# Altium project dsp_board.PrjPcb
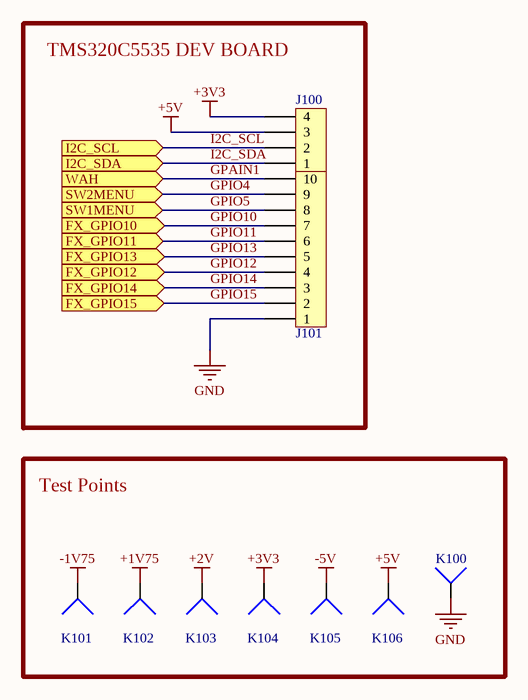
[diagram p0: main.SchDoc]
6 sheets, 140 parts. Net scope: flat (ports and power ports of the same name join across sheets).
Board files: PCB2.PcbDoc, PCBV4.PcbDoc
Sheets:
  main.SchDoc
  switches_connectors.SchDoc
  amplifier_stage.SchDoc
  switches_LEDs.SchDoc
  regulators.SchDoc
  power_supply.SchDoc

## Sheet main.SchDoc
size A4; SheetNumber: 1; SheetTotal: 6

### Parts
J100  Header 1x4  [Header 1x4]  (value not drawn)
J101  Header 1x10  [Header 1x10]  (value not drawn)
K100  Wire  [Wire 1.5mm]  (value not drawn)
K101  Wire  [Wire 1.5mm]  (value not drawn)
K102  Wire  [Wire 1.5mm]  (value not drawn)
K103  Wire  [Wire 1.5mm]  (value not drawn)
K104  Wire  [Wire 1.5mm]  (value not drawn)
K105  Wire  [Wire 1.5mm]  (value not drawn)
K106  Wire  [Wire 1.5mm]  (value not drawn)

### Blocks framed on the sheet
TMS320C5535 DEV BOARD: J100 J101
Test Points: K100-K106

### Ports
FX_GPIO10 (in), FX_GPIO11 (in), FX_GPIO12 (in), FX_GPIO13 (in), FX_GPIO14 (in), FX_GPIO15 (in), I2C_SCL (in), I2C_SDA (in), SW1MENU (in), SW2MENU (in), WAH (in)

### Nets
+1V75: K102.1
+2V: K103.1
+3V3: J100.4 K104.1
+5V: J100.3 K106.1
-1V75: K101.1
-5V: K105.1
GND: J101.1 K100.1
GPAIN1: J101.10 ; port WAH
GPIO4: J101.9 ; port SW2MENU
GPIO5: J101.8 ; port SW1MENU
GPIO10: J101.7 ; port FX_GPIO10
GPIO11: J101.6 ; port FX_GPIO11
GPIO12: J101.4 ; port FX_GPIO12
GPIO13: J101.5 ; port FX_GPIO13
GPIO14: J101.3 ; port FX_GPIO14
GPIO15: J101.2 ; port FX_GPIO15
I2C_SCL: J100.2 ; port I2C_SCL
I2C_SDA: J100.1 ; port I2C_SDA

### Notes on the sheet
- Title
- Size:
- Date:
- A4
- Project:
- Time:
- Version:
- Sheet
- of
- File:
- Author:

## Sheet switches_connectors.SchDoc
size A4; SheetNumber: 2; SheetTotal: 6
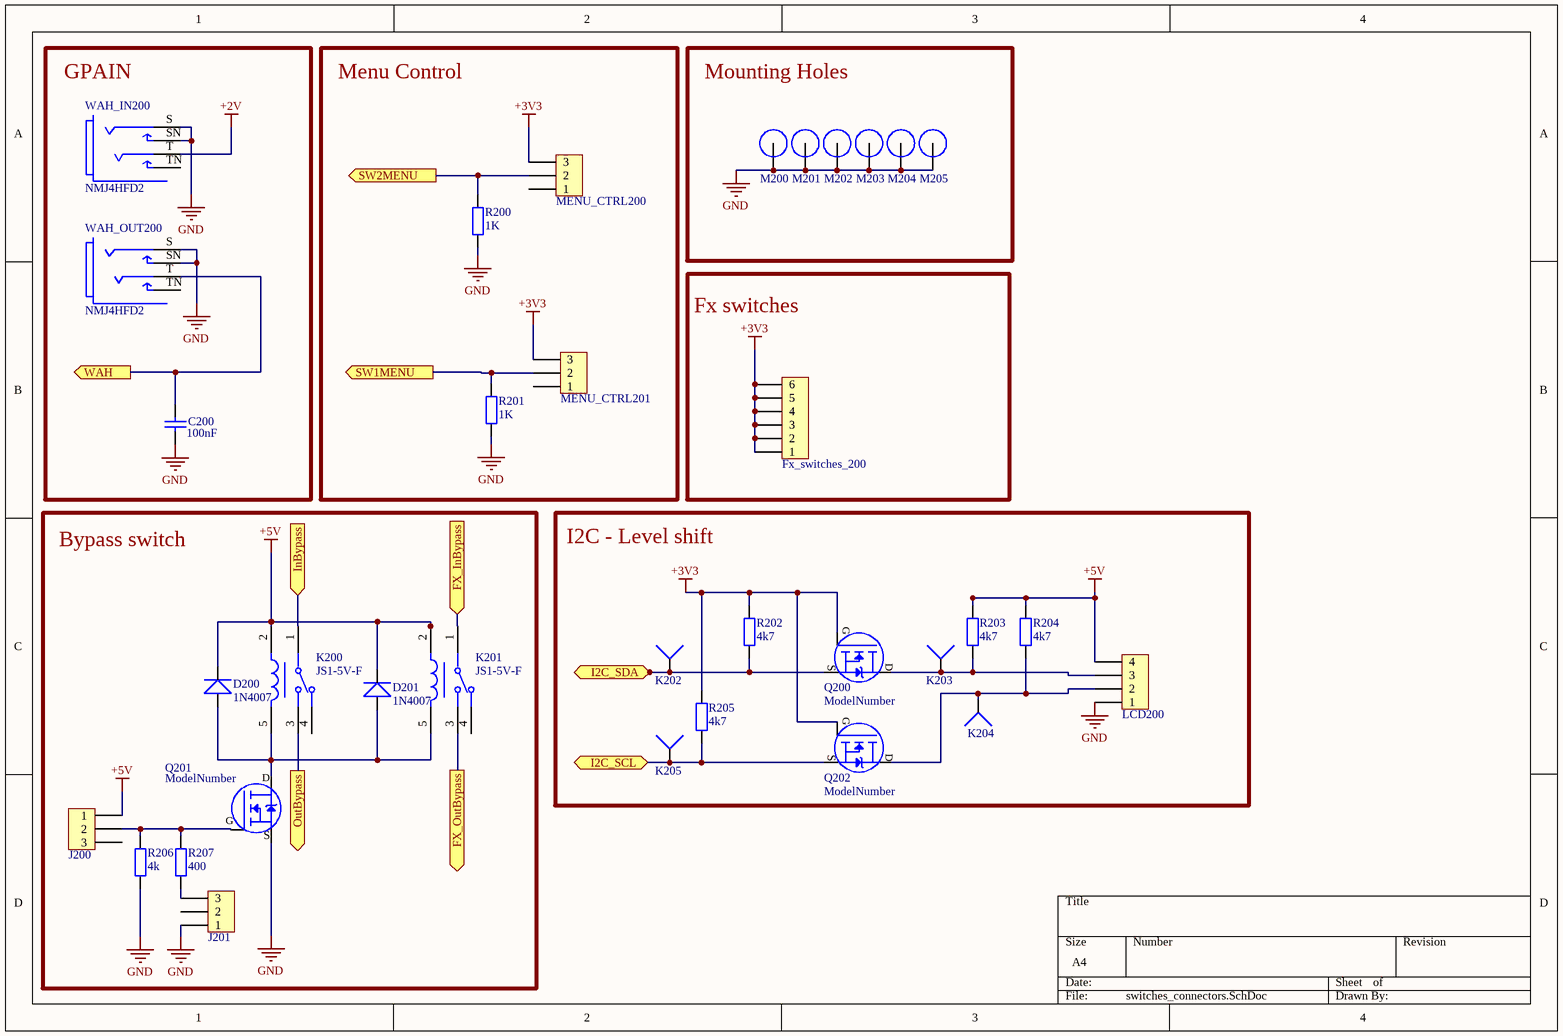
[diagram p1: switches_connectors.SchDoc]

### Parts
C200  value 100nF  [Cap-1]  (hidden comment: Cap)
D200  1N4007  [1N4007]
D201  1N4007  [1N4007]
Fx_switches_200  Header 1x6  [Header 1x6]  (value not drawn)
J200  Header 1x3  [Header 1x3]  (value not drawn)
J201  Header 1x3  [Header 1x3]  (value not drawn)
K200  JS1-5V-F  [FP-JS1-5V-F-MFG]
K201  JS1-5V-F  [FP-JS1-5V-F-MFG]
K202  Wire  [Wire 1.5mm]  (value not drawn)
K203  Wire  [Wire 1.5mm]  (value not drawn)
K204  Wire  [Wire 1.5mm]  (value not drawn)
K205  Wire  [Wire 1.5mm]  (value not drawn)
LCD200  Header 1x4  [Header 1x4]  (value not drawn)
M200  Screw Hole  [M3 Hole]  (value not drawn)  (no BOM)
M201  Screw Hole  [M3 Hole]  (value not drawn)  (no BOM)
M202  Screw Hole  [M3 Hole]  (value not drawn)  (no BOM)
M203  Screw Hole  [M3 Hole]  (value not drawn)  (no BOM)
M204  Screw Hole  [M3 Hole]  (value not drawn)  (no BOM)
M205  Screw Hole  [M3 Hole]  (value not drawn)  (no BOM)
MENU_CTRL200  Header 1x3  [Header 1x3]  (value not drawn)
MENU_CTRL201  Header 1x3  [Header 1x3]  (value not drawn)
Q200  Model: ModelNumber  [TO-92_straight]  (hidden comment: ModelNum)
Q201  Model: ModelNumber  [TO-220]  (hidden comment: ModelNum)
Q202  Model: ModelNumber  [TO-92_straight]  (hidden comment: ModelNum)
R200  value 1K  [RES THT 9mm]  (hidden comment: Resistor)
R201  value 1K  [RES THT 9mm]  (hidden comment: Resistor)
R202  value 4k7  [RES THT 9mm]  (hidden comment: Resistor)
R203  value 4k7  [RES THT 9mm]  (hidden comment: Resistor)
R204  value 4k7  [RES THT 9mm]  (hidden comment: Resistor)
R205  value 4k7  [RES THT 9mm]  (hidden comment: Resistor)
R206  value 4k  [RES THT 9mm]  (hidden comment: Resistor)
R207  value 400  [RES THT 9mm]  (hidden comment: Resistor)
WAH_IN200  NMJ4HFD2  [FP-NMJ4HFD2-MFG]
WAH_OUT200  NMJ4HFD2  [FP-NMJ4HFD2-MFG]

### Blocks framed on the sheet
GPAIN: C200 WAH_IN200 WAH_OUT200
Menu Control: MENU_CTRL200 MENU_CTRL201 R200 R201
Mounting Holes: M200-M205
Fx switches: Fx_switches_200
Bypass switch: D200 D201 J200 J201 K200 K201 Q201 R206 R207
I2C - Level shift: K202-K205 LCD200 Q200 Q202 R202-R205

### Ports
FX_InBypass (in), FX_OutBypass (out), I2C_SCL (bidir), I2C_SDA (bidir), InBypass (in), OutBypass (out), SW1MENU (out), SW2MENU (out), WAH (out)

### Nets
+2V: WAH_IN200.T
+3V3: Fx_switches_200.1 Fx_switches_200.2 Fx_switches_200.3 Fx_switches_200.4 Fx_switches_200.5 Fx_switches_200.6 MENU_CTRL200.3 MENU_CTRL201.3 Q200.1(G) Q202.1(G) R202.2 R205.2
+5V: D200.2 D201.2 J200.1 K200.2(1_COIL) K201.2(1_COIL) LCD200.4 R203.2 R204.2
GND: C200.1 J201.1 LCD200.1 M200.1 M201.1 M202.1 M203.1 M204.1 M205.1 Q201.3(S) R200.1 R201.1 R206.1 WAH_IN200.S WAH_IN200.SN WAH_OUT200.S WAH_OUT200.SN
GPAIN1: C200.2(g) WAH_OUT200.T ; port WAH
GPIO4: MENU_CTRL200.2 R200.2 ; port SW2MENU
GPIO5: MENU_CTRL201.2 R201.2 ; port SW1MENU
I2C_SCL: K205.1 Q202.3(S) R205.1 ; port I2C_SCL
I2C_SDA: K202.1 Q200.3(S) R202.1 ; port I2C_SDA
NetC302_1: K200.3(N.O.) ; port OutBypass
NetC303_1: K201.3(N.O.) ; port FX_OutBypass
NetD200_1: D200.1 D201.1 K200.5(2_COIL) K201.5(2_COIL) Q201.2(D)
NetD300_1: K200.1(COM) ; port InBypass
NetFX_LOOP_IN300_T: K201.1(COM) ; port FX_InBypass
NetJ200_2: J200.2 Q201.1(G) R206.2 R207.2
NetJ201_3: J201.3 R207.1
NetK203_1: K203.1 LCD200.3 Q200.2(D) R203.1
NetK204_1: K204.1 LCD200.2 Q202.2(D) R204.1

Not connected (* = marked no-connect by the designer): J200 3; J201 2; K200 4(N.C.); K201 4(N.C.); MENU_CTRL200 1; MENU_CTRL201 1; WAH_IN200 TN; WAH_OUT200 TN

### Library data of the parts
C200 = Capacitor 1 space
K200 K201 = CMP-05606-000016-1: RELAY GEN PURPOSE SPDT 10A 5V; Manufacturer: Panasonic; Coil Type: Non-Latching; Number Of Contacts: 1; Standoff Height: 0.3mm; Switching Power: 150W; Coil Power: 360mW; Coil Current: 72mA; Coil Resistance: 69.4Ω; Lead Free: Yes; Device Class L3: Power Relays; Device Class L1: Electromechanical; Ambient Temperature Range High: +70°C; Temperature: -40°C to +70°C; Temperature Range High: +70°C; Temperature Range Low: -40°C; Manufacturer Part Number: JS1-5V-F; Coil Voltage: 5V; Switching Current: 10A; Digikey Description: RELAY GEN PURPOSE SPDT 10A 5V; Device Class L2: Relays; Ambient Temperature Range Low: -40°C; Throw Configuration: SPDT; Category: Relay; ComponentLink2URL: https://www3.panasonic.biz/ac/e_download/control/relay/power/catalog/mech_eng_js.pdf?via=ok; Package: JS1-5V-F; Octopart: https://octopart.com/js1-5v-f-panasonic-39428621; Mouser Description: JS Series 10 A SPDT 5 V Through Hole Sealed Miniature Non-Polarized Power Relay; Height: 16.8mm; ComponentLink2Description: Datasheet; RoHS: TRUE; Automotive: No
Q200 Q202 = MOSFET N-Channel: pin to pad: 2>3 3>2
Q201 = MOSFET N-Channel
WAH_IN200 WAH_OUT200 = CMP-78736-000001-1: Conn 1/4" Mono Jack F 3 POS Solder RA Thru-Hole 3 Terminal 1 Port; Manufacturer: Neutrik; Number Of Contacts: 2; Current Rating: 0.5A; Voltage Rating: 50V; Conn Orientation: Horizontal; Is Female: yes; Temperature: -25°C to +70°C; ComponentLink2Description: Datasheet; ComponentLink2URL: https://www.neutrik.com/en/product/nmj4hfd2.pdf; Contact Material: Silver; Height: 15.89mm; Package: 0; Mouser Description: Phone Audio Connector, Socket, 2, PCB Mount, Metal Body, Silver Plated Contacts; Manufacturer Part Number: NMJ4HFD2; Automotive: No; RoHS: TRUE; Lead Free: Yes; Device Class L2: Audio / Video Connectors; Device Class L3: unset; Temperature Range Low: -25°C; Category: Conn; Footprint Url: https://www.neutrik.com/media/8576/download/st-nmj4hfd2.pdf?v=1; Temperature Range High: +70°C; Device Class L1: Connectors; Octopart: https://octopart.com/nmj4hfd2-neutrik-758952

## Sheet amplifier_stage.SchDoc
size A4; SheetNumber: 3; SheetTotal: 6
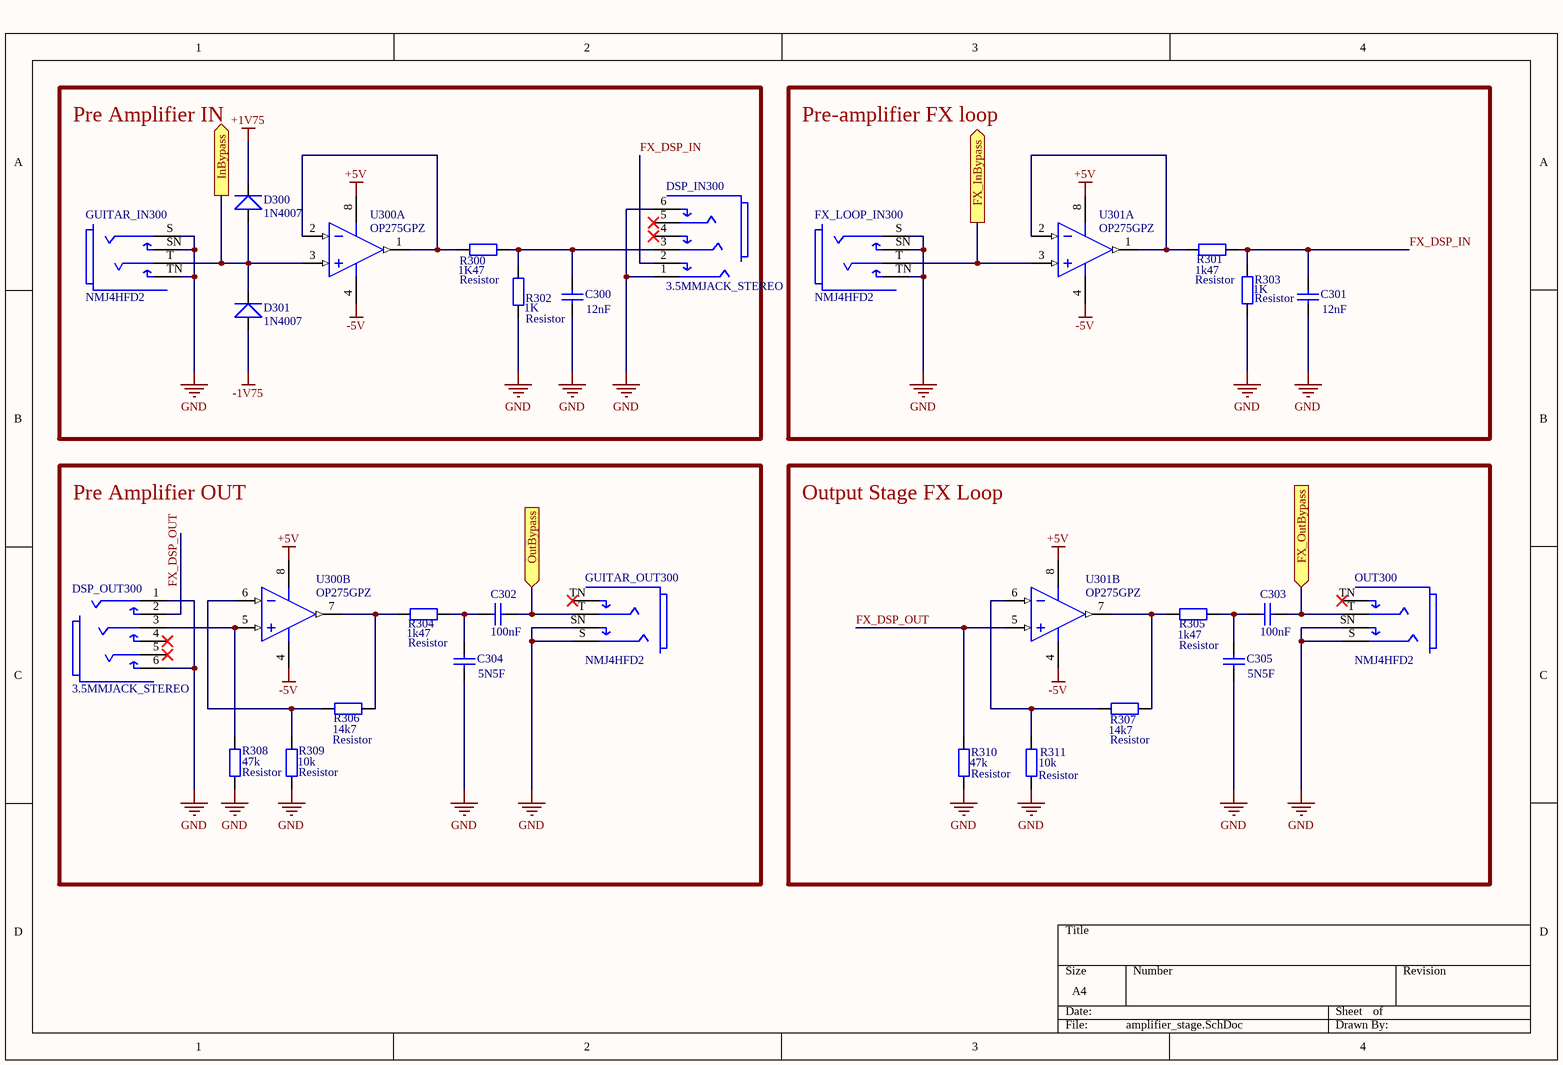
[diagram p2: amplifier_stage.SchDoc]

### Parts
C300  value 12nF  [Cap-1]  (hidden comment: Cap)
C301  value 12nF  [Cap-1]  (hidden comment: Cap)
C302  value 100nF  [Cap-1]  (hidden comment: Cap)
C303  value 100nF  [Cap-1]  (hidden comment: Cap)
C304  value 5N5F  [Cap-1]  (hidden comment: Cap)
C305  value 5N5F  [Cap-1]  (hidden comment: Cap)
D300  1N4007  [1N4007]
D301  1N4007  [1N4007]
DSP_IN300  3.5MMJACK_STEREO  [3.5MMJACK_STEREO]
DSP_OUT300  3.5MMJACK_STEREO  [3.5MMJACK_STEREO]
FX_LOOP_IN300  NMJ4HFD2  [FP-NMJ4HFD2-MFG]
GUITAR_IN300  NMJ4HFD2  [FP-NMJ4HFD2-MFG]
GUITAR_OUT300  NMJ4HFD2  [FP-NMJ4HFD2-MFG]
OUT300  NMJ4HFD2  [FP-NMJ4HFD2-MFG]
R300  Resistor  value 1K47  [RES THT 9mm]
R301  Resistor  value 1k47  [RES THT 9mm]
R302  Resistor  value 1K  [RES THT 9mm]
R303  Resistor  value 1K  [RES THT 9mm]
R304  Resistor  value 1k47  [RES THT 9mm]
R305  Resistor  value 1k47  [RES THT 9mm]
R306  Resistor  value 14k7  [RES THT 9mm]
R307  Resistor  value 14k7  [RES THT 9mm]
R308  Resistor  value 47k  [RES THT 9mm]
R309  Resistor  value 10k  [RES THT 9mm]
R310  Resistor  value 47k  [RES THT 9mm]
R311  Resistor  value 10k  [RES THT 9mm]
U300  OP275GPZ  [ADI-N-8]  (parts A,B of 2)
U301  OP275GPZ  [ADI-N-8]  (parts A,B of 2)

### Blocks framed on the sheet
Pre Amplifier IN: C300 D300 D301 DSP_IN300 GUITAR_IN300 R300 R302 U300
Pre-amplifier FX loop: C301 FX_LOOP_IN300 R301 R303 U301
Pre Amplifier OUT: C302 C304 DSP_OUT300 GUITAR_OUT300 R304 R306 R308 R309 U300
Output Stage FX Loop: C303 C305 OUT300 R305 R307 R310 R311 U301

### Ports
FX_InBypass (out), FX_OutBypass (in), InBypass (out), OutBypass (in)

### Nets
+1V75: D300.2
+5V: U300.8(+V) U301.8(+V)
-1V75: D301.1
-5V: U300.4(-V) U301.4(-V)
GND: C300.1 C301.1 C304.1 C305.1 DSP_IN300.1(S) DSP_IN300.6(TN) DSP_OUT300.1(S) DSP_OUT300.6(TN) FX_LOOP_IN300.S FX_LOOP_IN300.SN FX_LOOP_IN300.TN GUITAR_IN300.S GUITAR_IN300.SN GUITAR_IN300.TN GUITAR_OUT300.S GUITAR_OUT300.SN OUT300.S OUT300.SN R302.1 R303.1 R308.1 R309.1 R310.1 R311.1
FX_DSP_IN: C301.2(g) DSP_IN300.2(SN) R301.2 R303.2
FX_DSP_OUT: DSP_OUT300.2(SN) R310.2 U301.5(+IN_B)
NetC300_2: C300.2(g) DSP_IN300.3(S) R300.2 R302.2
NetC302_1: C302.1 GUITAR_OUT300.T ; port OutBypass
NetC302_2: C302.2(g) C304.2(g) R304.2
NetC303_1: C303.1 OUT300.T ; port FX_OutBypass
NetC303_2: C303.2(g) C305.2(g) R305.2
NetD300_1: D300.1 D301.2 GUITAR_IN300.T U300.3(+IN_A) ; port InBypass
NetDSP_OUT300_3: DSP_OUT300.3(S) R308.2 U300.5(+IN_B)
NetFX_LOOP_IN300_T: FX_LOOP_IN300.T U301.3(+IN_A) ; port FX_InBypass
NetR300_1: R300.1 U300.1(OUT_A) U300.2(-IN_A)
NetR301_1: R301.1 U301.1(OUT_A) U301.2(-IN_A)
NetR304_1: R304.1 R306.2 U300.7(OUT_B)
NetR305_1: R305.1 R307.2 U301.7(OUT_B)
NetR306_1: R306.1 R309.2 U300.6(-IN_B)
NetR307_1: R307.1 R311.2 U301.6(-IN_B)

Not connected (* = marked no-connect by the designer): DSP_IN300 4(SN)* 5(T)*; DSP_OUT300 4(SN)* 5(T)*; GUITAR_OUT300 TN*; OUT300 TN*

### Library data of the parts
C300-C305 = Capacitor 1 space
FX_LOOP_IN300 GUITAR_IN300 GUITAR_OUT300 OUT300 = CMP-78736-000001-1: as WAH_IN200 on sheet switches_connectors; Temperature: -25°C to +70°C; ComponentLink2Description: Datasheet; ComponentLink2URL: https://www.neutrik.com/en/product/nmj4hfd2.pdf; Contact Material: Silver; Height: 15.89mm; Package: 0; Mouser Description: Phone Audio Connector, Socket, 2, PCB Mount, Metal Body, Silver Plated Contacts; Manufacturer Part Number: NMJ4HFD2; Automotive: No; RoHS: TRUE; Lead Free: Yes; Device Class L2: Audio / Video Connectors; Device Class L3: unset; Temperature Range Low: -25°C; Category: Conn; Footprint Url: https://www.neutrik.com/media/8576/download/st-nmj4hfd2.pdf?v=1; Temperature Range High: +70°C; Device Class L1: Connectors; Octopart: https://octopart.com/nmj4hfd2-neutrik-758952
U300 U301 = CMP-0384-00207-1: Double Channel Excellent Sonic Characteristics Operational Amplifier, 9 MHz BW, 22 V/us SR, Industrial, 8-pin DIP (N-8), Tube; Manufacturer: Analog Devices; Generic Part Number: OP275; V Span Min: 9V; Slew Rate: 22V/us; Iq/Amp: 2.5mA; Input Offset Voltage: 1mV; Small Signal Bandwidth: 9MHz; Amplifiers Per Package: 2; V Span Max: 44V; Input Bias Current: 100nA; ComponentLink3Description: Package Specification; ComponentLink3URL: http:/www.analog.com/static/imported-files/packages/PKG_PDF/PDIP(N)/N_8.pdf; Mounting Technology: Through Hole; ComponentLink1Description: Manufacturer URL; ComponentLink2URL: http://www.analog.com/static/imported-files/data_sheets/OP275.pdf; PartNumber: OP275GPZ; ComponentLink1URL: http://www.analog.com/en/index.html; PackageReference: N-8; ComponentLink2Description: Datasheet; DatasheetVersion: Rev. C; PackageDescription: 8-Pin Plastic Dual In-Line Package, Row spacing 7.62 mm, Pitch 2.54 mm; PackageVersion: 070606-A; Code_JEDEC: MS-001

## Sheet switches_LEDs.SchDoc
size A4; SheetNumber: 4; SheetTotal: 6
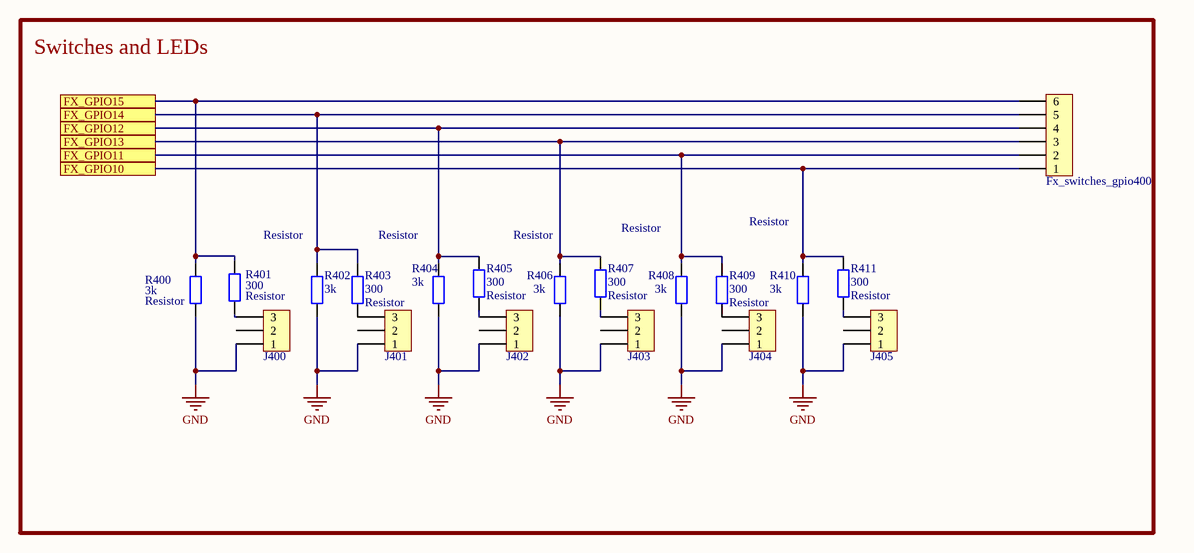
[diagram p3: switches_LEDs.SchDoc]

### Parts
Fx_switches_gpio400  Header 1x6  [Header 1x6]  (value not drawn)
J400  Header 1x3  [Header 1x3]  (value not drawn)
J401  Header 1x3  [Header 1x3]  (value not drawn)
J402  Header 1x3  [Header 1x3]  (value not drawn)
J403  Header 1x3  [Header 1x3]  (value not drawn)
J404  Header 1x3  [Header 1x3]  (value not drawn)
J405  Header 1x3  [Header 1x3]  (value not drawn)
R400  Resistor  value 3k  [RES THT 9mm]
R401  Resistor  value 300  [RES THT 9mm]
R402  Resistor  value 3k  [RES THT 9mm]
R403  Resistor  value 300  [RES THT 9mm]
R404  Resistor  value 3k  [RES THT 9mm]
R405  Resistor  value 300  [RES THT 9mm]
R406  Resistor  value 3k  [RES THT 9mm]
R407  Resistor  value 300  [RES THT 9mm]
R408  Resistor  value 3k  [RES THT 9mm]
R409  Resistor  value 300  [RES THT 9mm]
R410  Resistor  value 3k  [RES THT 9mm]
R411  Resistor  value 300  [RES THT 9mm]

### Blocks framed on the sheet
Switches and LEDs: Fx_switches_gpio400 J400-J405 R400-R411

### Ports
FX_GPIO10, FX_GPIO11, FX_GPIO12, FX_GPIO13, FX_GPIO14, FX_GPIO15

### Nets
GND: J400.1 J401.1 J402.1 J403.1 J404.1 J405.1 R400.1 R402.1 R404.1 R406.1 R408.1 R410.1
GPIO10: Fx_switches_gpio400.1 R410.2 R411.2 ; port FX_GPIO10
GPIO11: Fx_switches_gpio400.2 R408.2 R409.2 ; port FX_GPIO11
GPIO12: Fx_switches_gpio400.4 R404.2 R405.2 ; port FX_GPIO12
GPIO13: Fx_switches_gpio400.3 R406.2 R407.2 ; port FX_GPIO13
GPIO14: Fx_switches_gpio400.5 R402.2 R403.2 ; port FX_GPIO14
GPIO15: Fx_switches_gpio400.6 R400.2 R401.2 ; port FX_GPIO15
NetJ400_3: J400.3 R401.1
NetJ401_3: J401.3 R403.1
NetJ402_3: J402.3 R405.1
NetJ403_3: J403.3 R407.1
NetJ404_3: J404.3 R409.1
NetJ405_3: J405.3 R411.1

Not connected (* = marked no-connect by the designer): J400 2; J401 2; J402 2; J403 2; J404 2; J405 2

## Sheet regulators.SchDoc
size A4; SheetNumber: 5; SheetTotal: 6
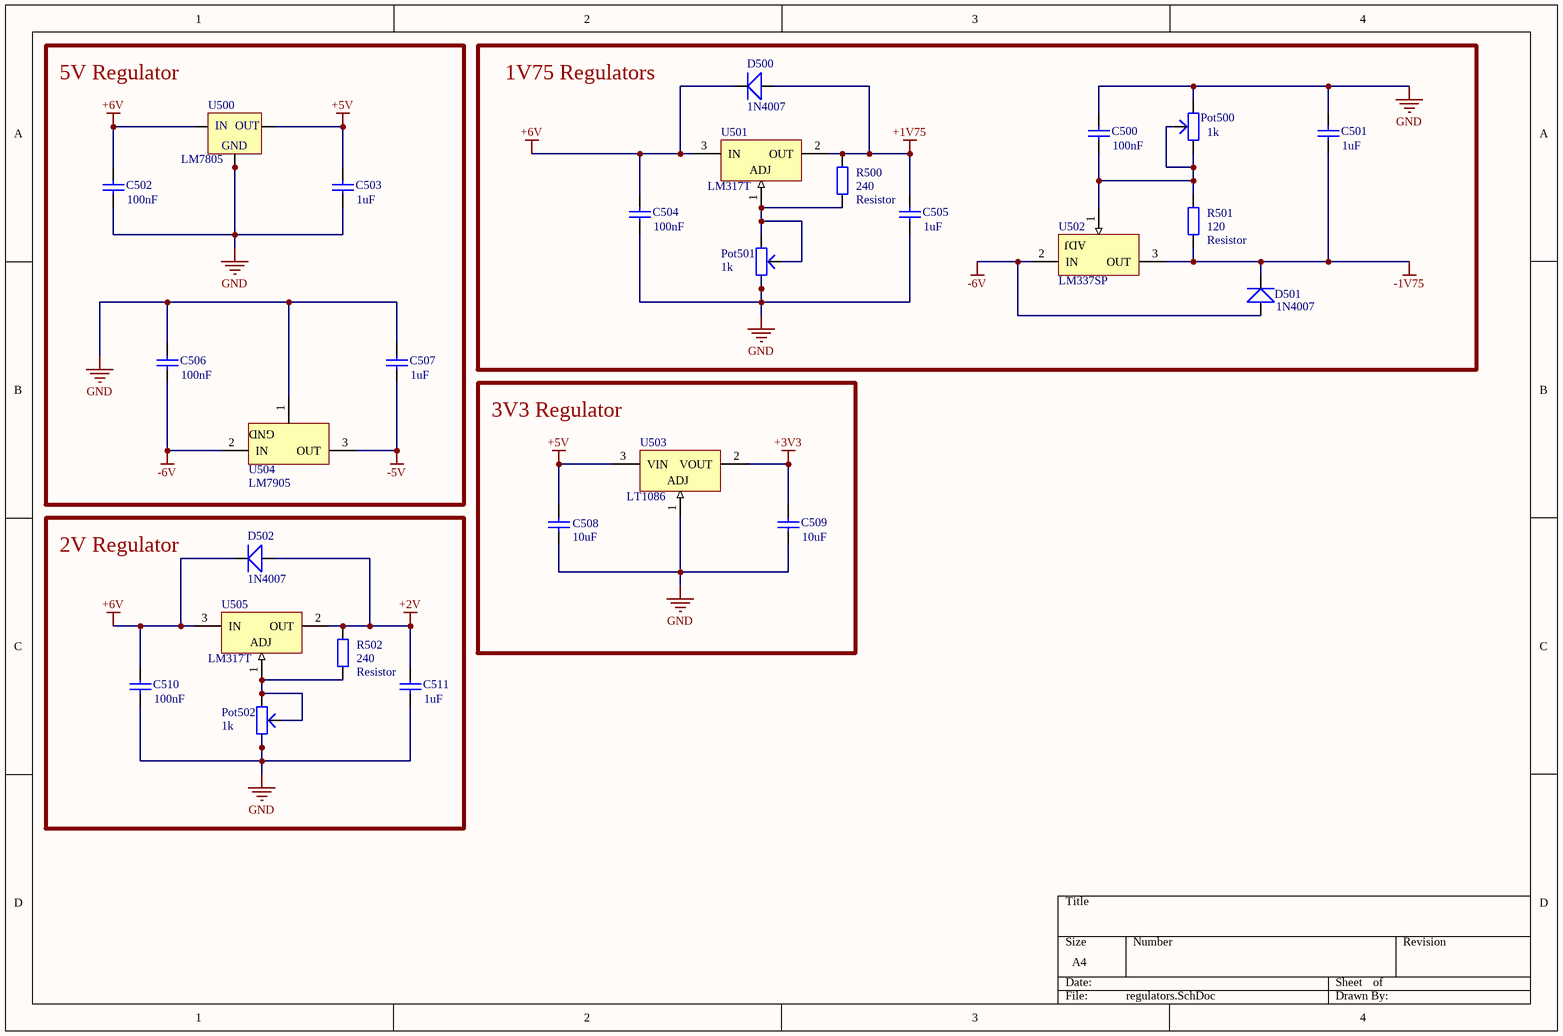
[diagram p4: regulators.SchDoc]

### Parts
C500  value 100nF  [Cap-1]  (hidden comment: Cap)
C501  value 1uF  [Cap-1]  (hidden comment: Cap)
C502  value 100nF  [Cap-1]  (hidden comment: Cap)
C503  value 1uF  [Cap-1]  (hidden comment: Cap)
C504  value 100nF  [Cap-1]  (hidden comment: Cap)
C505  value 1uF  [Cap-1]  (hidden comment: Cap)
C506  value 100nF  [Cap-1]  (hidden comment: Cap)
C507  value 1uF  [Cap-1]  (hidden comment: Cap)
C508  value 10uF  [Cap-1]  (hidden comment: Cap)
C509  value 10uF  [Cap-1]  (hidden comment: Cap)
C510  value 100nF  [Cap-1]  (hidden comment: Cap)
C511  value 1uF  [Cap-1]  (hidden comment: Cap)
D500  1N4007  [1N4007]
D501  1N4007  [1N4007]
D502  1N4007  [1N4007]
Pot500  value 1k  [Pot trim slim high]  (hidden comment: Pot Trim)
Pot501  value 1k  [Pot trim slim high]  (hidden comment: Pot Trim)
Pot502  value 1k  [Pot trim slim high]  (hidden comment: Pot Trim)
R500  Resistor  value 240  [RES THT 9mm]
R501  Resistor  value 120  [RES THT 9mm]
R502  Resistor  value 240  [RES THT 9mm]
U500  LM7805  [TO-220]
U501  LM317T  [TO-220]
U502  LM337SP  [TO220]
U503  LT1086  [LT-T-3]
U504  LM7905  [NDE0003A]
U505  LM317T  [TO-220]

### Blocks framed on the sheet
5V Regulator: C502 C503 C506 C507 U500 U504
1V75 Regulators: C500 C501 C504 C505 D500 D501 Pot500 Pot501 R500 R501 U501 U502
3V3 Regulator: C508 C509 U503
2V Regulator: C510 C511 D502 Pot502 R502 U505

### Nets
+1V75: C505.2(g) D500.1 R500.2 U501.2(OUT)
+2V: C511.2(g) D502.1 R502.2 U505.2(OUT)
+3V3: C509.2(g) U503.2(VOUT)
+5V: C503.2(g) C508.2(g) U500.3(OUT) U503.3(VIN)
+6V: C502.2(g) C504.2(g) C510.2(g) D500.2 D502.2 U500.1(IN) U501.3(IN) U505.3(IN)
-1V75: C501.1 D501.2 R501.1 U502.3(OUT)
-5V: C507.1 U504.3(OUT)
-6V: C506.1 D501.1 U502.2(IN) U504.2(IN)
GND: C500.2(g) C501.2(g) C502.1 C503.1 C504.1 C505.1 C506.2(g) C507.2(g) C508.1 C509.1 C510.1 C511.1 Pot500.1 Pot501.1 Pot502.1 U500.2(GND) U500.4(GND) U503.1(ADJ) U504.1(GND)
NetC500_1: C500.1 Pot500.2 Pot500.3 R501.2 U502.1(ADJ)
NetPot501_2: Pot501.2 Pot501.3 R500.1 U501.1(ADJ)
NetPot502_2: Pot502.2 Pot502.3 R502.1 U505.1(ADJ)

### Library data of the parts
C500-C511 = Capacitor 1 space
Pot500-Pot502 = Pot Trim: Potentiometer
U500 = Voltage Regulator: pin to pad: 4>2
U501 U505 = CMP-0244-00444-1: 1.5A, 1.2V to 37V Adjustable Voltage Regulator, 3-Pin TO-220; PackageVersion: 2011; ComponentLink1URL: http://www.st.com; ComponentLink2URL: http://www.st.com/internet/com/TECHNICAL_RESOURCES/TECHNICAL_LITERATURE/DATASHEET/CD00000455.pdf; PackageDescription: TO, Thru-Hole, Vertical, Heatsink Mounted; 3 In-Line Leads; Pitch 2.54 mm; PackageReference: TO-220; ComponentLink1Description: Manufacturer URL; ComponentLink3URL: http://www.st.com/internet/com/TECHNICAL_RESOURCES/TECHNICAL_LITERATURE/PACKAGE_INFORMATION/CD00004649.pdf; DatasheetVersion: 1/11/2011; ComponentLink2Description: Datasheet; ComponentLink3Description: Package Specification
U502 = CMP-0244-00420-1: Three-Terminal Negative Voltage Regulator, 3-Pin TO-220; PackageReference: TO220; DatasheetVersion: 1/10/2011; ComponentLink3Description: Package Specification; ComponentLink3URL: http://www.st.com/internet/com/TECHNICAL_RESOURCES/TECHNICAL_LITERATURE/PACKAGE_INFORMATION/CD00004649.pdf; PackageDescription: TO, Thru-Hole, Vertical, Heatsink Mounted; 3 In-Line Leads; Pitch 2.54 mm; PackageVersion: ver3.0; ComponentLink1Description: Manufacturer URL; ComponentLink1URL: http://www.st.com; ComponentLink2Description: Datasheet; ComponentLink2URL: http://www.st.com/internet/com/TECHNICAL_RESOURCES/TECHNICAL_LITERATURE/DATASHEET/CD00000468.pdf
U503 = CMP-0476-01904-1: 1.5 A Low Dropout Positive Regulator, 2.55 to 25 V Vin, Adjustable Vout, 3-pin FM (T-3), 0 to 150 degC, Pb-Free; Manufacturer: Linear Technology; PartNumber: LT1086CT#PBF; Vout Min(V): 1.25; Iout(mA): 1500; Dropout Voltage(V): 1.3; Output Voltage: Adj; Vout Max(V): 23.5; PSRR(dB): 75; Vin Max(V): 25; Number of Outputs: 1; Isupply(mA): 5; Discrete Pass Element: no; Vin Min(V): 2.55; ComponentLink3URL: http://cds.linear.com/docs/en/packaging/TO-220_3_05-08-1420.pdf; PackageVersion: Jun-10; ComponentLink1URL: http://www.linear.com/; ComponentLink2Description: Datasheet; PackageReference: T-3; RoHS: TRUE; ComponentLink2URL: http://cds.linear.com/docs/en/datasheet/1086ffs.pdf; DatasheetVersion: Rev. F; Mounting Technology: Through Hole; ComponentLink3Description: Package Specification; ComponentLink1Description: Manufacturer URL; PackageDescription: 3-Pin Plastic TO-220, Body 10.2235 x 4.3815 mm, Pitch 2.54 mm
U504 = CMP-0062-02481-3: 3-Terminal Negative Regulator, 3-pin TO-220, Pb-Free; Manufacturer: Texas Instruments; PackageTopMarking: NSUZXYTTE#*LM7905CT; CompType: LDO IC; PowerWise: N; PackageDescription: TO-220, Molded, 3 Lead, Straight; ComponentLink1Description: Datasheet URL; ComponentLink1URL: http://www.ti.com/general/docs/lit/getliterature.tsp?genericPartNumber=LM7905&fileType=pdf; PackageReference: NDE0003A; RoHS: Y; PinCount: 3

## Sheet power_supply.SchDoc
size A4; SheetNumber: 6; SheetTotal: 6
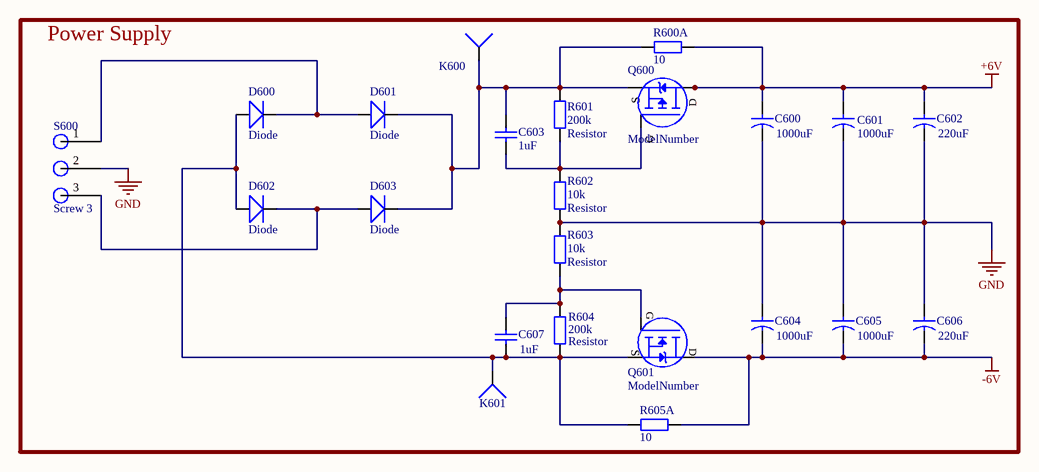
[diagram p5: power_supply.SchDoc]

### Parts
C600  value 1000uF  [Cap Lyt Ø18]  (hidden comment: Cap)
C601  value 1000uF  [Cap Lyt Ø18]  (hidden comment: Cap)
C602  value 220uF  [Cap Lyt Ø8]  (hidden comment: Cap)
C603  value 1uF  [Cap-1]  (hidden comment: Cap)
C604  value 1000uF  [Cap Lyt Ø18]  (hidden comment: Cap)
C605  value 1000uF  [Cap Lyt Ø18]  (hidden comment: Cap)
C606  value 220uF  [Cap Lyt Ø8]  (hidden comment: Cap)
C607  value 1uF  [Cap-1]  (hidden comment: Cap)
D600  Diode  [Diode 1A]
D601  Diode  [Diode 1A]
D602  Diode  [Diode 1A]
D603  Diode  [Diode 1A]
K600  Wire  [Wire 1.5mm]  (value not drawn)
K601  Wire  [Wire 1.5mm]  (value not drawn)
Q600  Model: ModelNumber  [TO-220]  (hidden comment: ModelNum)
Q601  Model: ModelNumber  [TO-220]  (hidden comment: ModelNum)
R600  10  [POW RES THT 13mm]  (part A of 2)
R601  Resistor  value 200k  [RES THT 9mm]
R602  Resistor  value 10k  [RES THT 9mm]
R603  Resistor  value 10k  [RES THT 9mm]
R604  Resistor  value 200k  [RES THT 9mm]
R605  10  [POW RES THT 13mm]  (part A of 2)
S600  Screw 3  [Screw-3]

### Blocks framed on the sheet
Power Supply: C600-C607 D600-D603 K600 K601 Q600 Q601 R600-R605 S600

### Nets
+6V: C600.1 C601.1 C602.1 Q600.3(D) Q600.4(D) R600.2
-6V: C604.2(g) C605.2(g) C606.2(g) Q601.2(D) R605.2
GND: C600.2(g) C601.2(g) C602.2(g) C604.1 C605.1 C606.1 R602.1 R603.2 S600.2
NetC603_1: C603.1 Q600.2(G) R601.1 R602.2
NetC603_2: C603.2(g) D601.2 D603.2 K600.1 Q600.1(S) R600.1 R601.2
NetC607_1: C607.1 D600.1 D602.1 K601.1 Q601.3(S) R604.1 R605.1
NetC607_2: C607.2(g) Q601.1(G) R603.1 R604.2
NetD600_2: D600.2 D601.1 S600.1
NetD602_2: D602.2 D603.1 S600.3

### Library data of the parts
C600-C602 C604-C606 = Capacitor electrolytic
C603 C607 = Capacitor 1 space
Q600 = MOSFET P-Channel
Q601 = MOSFET N-Channel
R600 R605 = POW RES THT 13mm

## Nets that join several sheets
+1V75: main (K102.1), amplifier_stage (D300.2), regulators (C505.2 D500.1 R500.2 U501.2)
+2V: main (K103.1), switches_connectors (WAH_IN200.T), regulators (C511.2 D502.1 R502.2 U505.2)
+3V3: main (J100.4 K104.1), switches_connectors (12 pins), regulators (C509.2 U503.2)
+5V: main (J100.3 K106.1), switches_connectors (8 pins), amplifier_stage (U300.8 U301.8), regulators (C503.2 C508.2 U500.3 U503.3)
+6V: regulators (8 pins), power_supply (6 pins)
-1V75: main (K101.1), amplifier_stage (D301.1), regulators (C501.1 D501.2 R501.1 U502.3)
-5V: main (K105.1), amplifier_stage (U300.4 U301.4), regulators (C507.1 U504.3)
-6V: regulators (C506.1 D501.1 U502.2 U504.2), power_supply (5 pins)
GND: main (J101.1 K100.1), switches_connectors (17 pins), amplifier_stage (24 pins), switches_LEDs (12 pins), regulators (19 pins), power_supply (9 pins)
GPAIN1: main (J101.10), switches_connectors (C200.2 WAH_OUT200.T)
GPIO4: main (J101.9), switches_connectors (MENU_CTRL200.2 R200.2)
GPIO5: main (J101.8), switches_connectors (MENU_CTRL201.2 R201.2)
GPIO10: main (J101.7), switches_LEDs (Fx_switches_gpio400.1 R410.2 R411.2)
GPIO11: main (J101.6), switches_LEDs (Fx_switches_gpio400.2 R408.2 R409.2)
GPIO12: main (J101.4), switches_LEDs (Fx_switches_gpio400.4 R404.2 R405.2)
GPIO13: main (J101.5), switches_LEDs (Fx_switches_gpio400.3 R406.2 R407.2)
GPIO14: main (J101.3), switches_LEDs (Fx_switches_gpio400.5 R402.2 R403.2)
GPIO15: main (J101.2), switches_LEDs (Fx_switches_gpio400.6 R400.2 R401.2)
I2C_SCL: main (J100.2), switches_connectors (K205.1 Q202.3 R205.1)
I2C_SDA: main (J100.1), switches_connectors (K202.1 Q200.3 R202.1)
NetC302_1: switches_connectors (K200.3), amplifier_stage (C302.1 GUITAR_OUT300.T)
NetC303_1: switches_connectors (K201.3), amplifier_stage (C303.1 OUT300.T)
NetD300_1: switches_connectors (K200.1), amplifier_stage (D300.1 D301.2 GUITAR_IN300.T U300.3)
NetFX_LOOP_IN300_T: switches_connectors (K201.1), amplifier_stage (FX_LOOP_IN300.T U301.3)